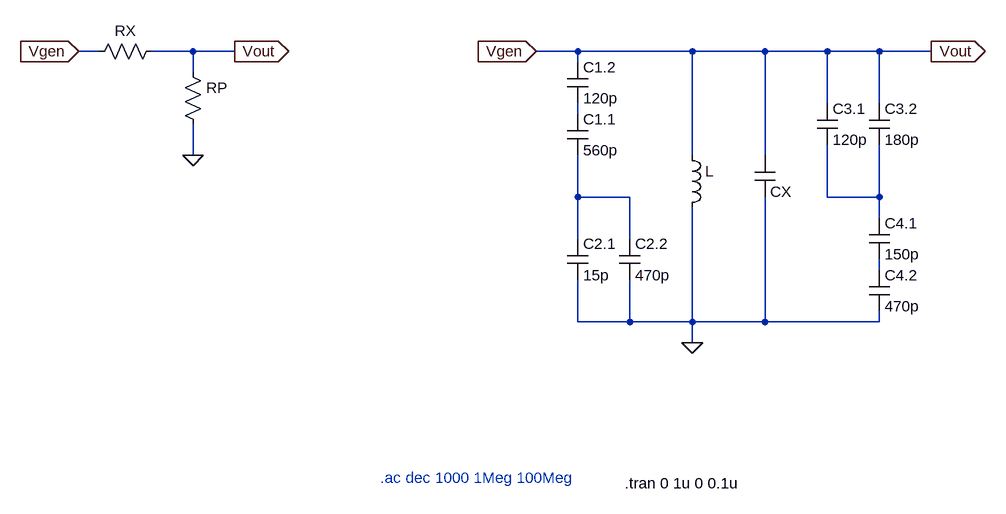
[diagram p0: schematic TP1.asc]
TP1.asc, the LTspice schematic file:
Version 4.1
SHEET 1 2172 1104
WIRE -624 32 -656 32
WIRE -480 32 -544 32
WIRE -416 32 -480 32
WIRE 112 32 48 32
WIRE 288 32 112 32
WIRE 400 32 288 32
WIRE 496 32 400 32
WIRE 576 32 496 32
WIRE 656 32 576 32
WIRE 112 48 112 32
WIRE -480 64 -480 32
WIRE 496 112 496 32
WIRE 576 112 576 32
WIRE 112 128 112 112
WIRE -480 192 -480 144
WIRE 288 192 288 32
WIRE 400 192 400 32
WIRE 112 256 112 192
WIRE 192 256 112 256
WIRE 496 256 496 176
WIRE 576 256 576 176
WIRE 576 256 496 256
WIRE 576 288 576 256
WIRE 112 320 112 256
WIRE 192 320 192 256
WIRE 576 368 576 352
WIRE 112 448 112 384
WIRE 192 448 192 384
WIRE 192 448 112 448
WIRE 288 448 288 272
WIRE 288 448 192 448
WIRE 400 448 400 256
WIRE 400 448 288 448
WIRE 576 448 576 432
WIRE 576 448 400 448
WIRE 288 480 288 448
FLAG 288 480 0
FLAG 656 32 Vout
IOPIN 656 32 Out
FLAG 48 32 Vgen
IOPIN 48 32 In
FLAG -416 32 Vout
IOPIN -416 32 Out
FLAG -656 32 Vgen
IOPIN -656 32 In
FLAG -480 192 0
SYMBOL cap 96 128 R0
SYMATTR InstName C1.1
SYMATTR Value 560p
SYMBOL cap 96 320 R0
SYMATTR InstName C2.1
SYMATTR Value 15p
SYMBOL cap 560 112 R0
SYMATTR InstName C3.2
SYMATTR Value 180p
SYMBOL cap 560 288 R0
SYMATTR InstName C4.1
SYMATTR Value 150p
SYMBOL ind 272 176 R0
WINDOW 3 36 68 Invisible 2
SYMATTR Value 1µ
SYMATTR InstName L
SYMBOL cap 96 48 R0
SYMATTR InstName C1.2
SYMATTR Value 120p
SYMBOL cap 176 320 R0
SYMATTR InstName C2.2
SYMATTR Value 470p
SYMBOL cap 480 112 R0
SYMATTR InstName C3.1
SYMATTR Value 120p
SYMBOL cap 560 368 R0
SYMATTR InstName C4.2
SYMATTR Value 470p
SYMBOL cap 384 192 R0
WINDOW 0 24 8 Invisible 2
SYMATTR InstName C1
SYMATTR Value CX
SYMBOL res -528 16 R90
WINDOW 0 0 56 VBottom 2
WINDOW 3 32 56 Invisible 2
SYMATTR InstName RX
SYMBOL res -496 48 R0
WINDOW 3 36 76 Invisible 2
SYMATTR InstName RP
TEXT -192 688 Left 2 ;.ac dec 1000 1Meg 100Meg
TEXT 184 696 Left 2 !.tran 0 1u 0 0.1u

The netlist it stands for:
* TP1.asc
C1.1 N001 N002 560p
C2.1 N002 0 15p
C3.2 Vgen N003 180p
C4.1 N003 N004 150p
L Vgen 0 1µ
C1.2 Vgen N001 120p
C2.2 N002 0 470p
C3.1 Vgen N003 120p
C4.2 N004 0 470p
C1 Vgen 0 CX
RX Vgen Vgen R
RP Vgen 0 R
* .ac dec 1000 1Meg 100Meg
.tran 0 1u 0 0.1u
.backanno
.end